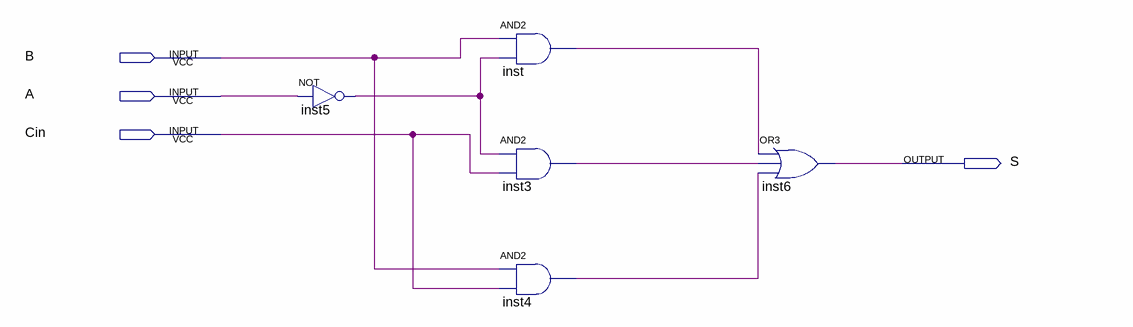
[diagram p0: schematic sheet]
// Quartus schematic Menorque_bitabit.bdf as structural Verilog: 5 symbols, 4 pins
module Menorque_bitabit (
  input  B,
  input  A,
  input  Cin,
  output S
);

  wire inst3_out, inst4_out, inst5_out, inst_out;

  not inst5 (inst5_out, A);
  and inst (inst_out, B, inst5_out);
  and inst3 (inst3_out, inst5_out, Cin);
  and inst4 (inst4_out, B, Cin);
  or inst6 (S, inst_out, inst3_out, inst4_out);
endmodule
